# Altium schematic sheet Power_Diagram.SchDoc
size A4
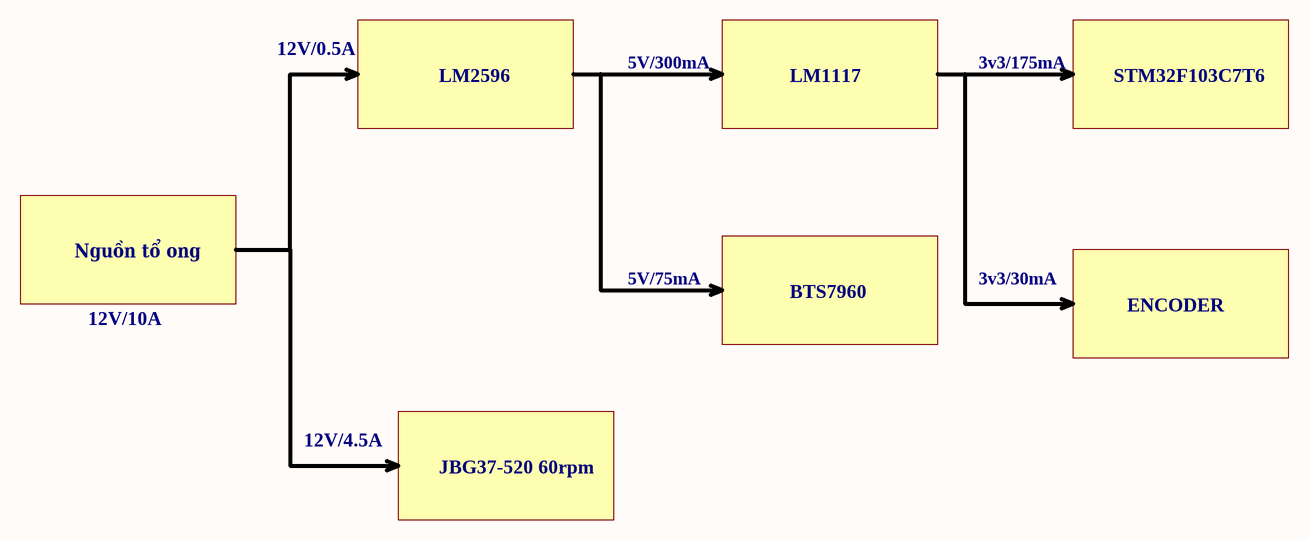
[diagram p0: Power_Diagram.SchDoc]

## Notes on the sheet
- 12V/0.5A
- LM2596
- 5V/300mA
- LM1117
- 3v3/175mA
- STM32F103C7T6
- Nguồn tổ ong
- 5V/75mA
- BTS7960
- 3v3/30mA
- 12V/10A
- ENCODER
- 12V/4.5A
- JBG37-520 60rpm